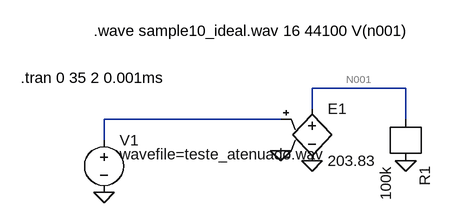
[diagram p0: schematic amp ideal.asc]
amp ideal.asc, the LTspice schematic file:
Version 4
SHEET 1 880 864
WIRE 192 560 48 560
WIRE 48 592 48 560
WIRE 0 608 -272 608
WIRE 192 608 192 560
WIRE -272 640 -272 608
FLAG -272 720 0
FLAG 192 672 0
FLAG 48 672 0
FLAG 0 656 0
SYMBOL voltage -272 624 R0
WINDOW 3 24 38 Left 2
SYMATTR Value wavefile=teste_atenuado.wav
SYMATTR InstName V1
SYMATTR Value2 AC 50m
SYMBOL r 192 608 R90
SYMATTR InstName R1
SYMATTR Value 100k
SYMBOL e 48 576 R0
SYMATTR InstName E1
SYMATTR Value 203.83
TEXT -288 472 Left 2 !.wave sample10_ideal.wav 16 44100 V(n001)
TEXT -400 544 Left 2 !.tran 0 35 2 0.001ms

The netlist it stands for:
* amp ideal.asc
V1 N002 0 wavefile=teste_atenuado.wav AC 50m
R1 0 N001 100k
E1 N001 0 N002 0 203.83
.wave sample10_ideal.wav 16 44100 V(n001)
.tran 0 35 2 0.001ms
.backanno
.end